# Altium schematic sheet LED_Board_Top.SchDoc: Top Sheet
size A; Author: Sam Tomlinson; SheetNumber: 1; SheetTotal: 6; TeamLead: John Ulm; ProjectTitle: LED Board
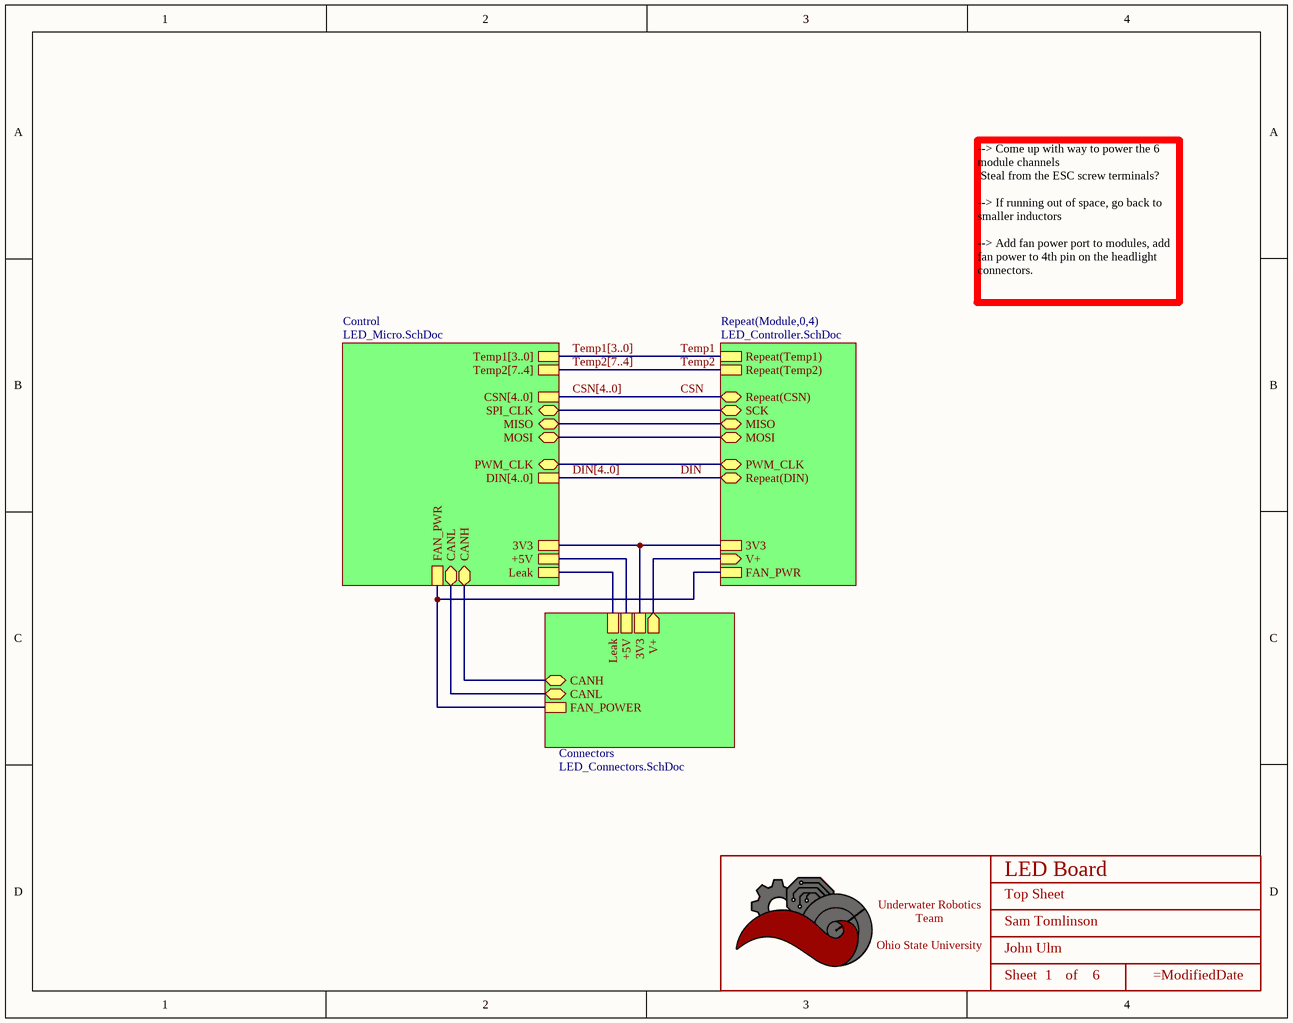
[diagram p0: LED_Board_Top.SchDoc]

## Parts
*  Title_Block  [LOGO]  (value not drawn)  (graphical)

## Sub-sheets
Connectors = LED_Connectors.SchDoc: Leak, +5V, 3V3, CANH (bidir), CANL (bidir), FAN_POWER, V+ (out)
Control = LED_Micro.SchDoc: +5V, 3V3, PWM_CLK (bidir), SPI_CLK (bidir), MISO (bidir), MOSI (bidir), CANH (bidir), CANL (bidir), FAN_PWR, DIN[4..0], CSN[4..0], Temp1[3..0], Leak, Temp2[7..4]
Repeat(Module,0,4) = LED_Controller.SchDoc: Repeat(CSN) (bidir), PWM_CLK (bidir), SCK (bidir), MOSI (bidir), MISO (bidir), Repeat(DIN) (bidir), V+ (in), Repeat(Temp1), 3V3, Repeat(Temp2), FAN_PWR

## Nets
CSN: sheet Repeat(Module,0,4)/Repeat(CSN)
DIN: sheet Repeat(Module,0,4)/Repeat(DIN)
Temp1: sheet Repeat(Module,0,4)/Repeat(Temp1)
Temp2: sheet Repeat(Module,0,4)/Repeat(Temp2)
(unnamed): sheet Connectors/Leak, sheet Control/Leak
(unnamed): sheet Connectors/+5V, sheet Control/+5V
(unnamed): sheet Connectors/3V3, sheet Control/3V3, sheet Repeat(Module,0,4)/3V3
(unnamed): sheet Connectors/CANH, sheet Control/CANH
(unnamed): sheet Connectors/CANL, sheet Control/CANL
(unnamed): sheet Connectors/FAN_POWER, sheet Control/FAN_PWR, sheet Repeat(Module,0,4)/FAN_PWR
(unnamed): sheet Connectors/V+, sheet Repeat(Module,0,4)/V+
(unnamed): sheet Control/PWM_CLK, sheet Repeat(Module,0,4)/PWM_CLK
(unnamed): sheet Control/SPI_CLK, sheet Repeat(Module,0,4)/SCK
(unnamed): sheet Control/MISO, sheet Repeat(Module,0,4)/MISO
(unnamed): sheet Control/MOSI, sheet Repeat(Module,0,4)/MOSI

## Buses and harness runs
bus CSN[4..0] = sheet Control/CSN[4..0]
bus DIN[4..0] = sheet Control/DIN[4..0]
bus Temp1[3..0] = sheet Control/Temp1[3..0]
bus Temp2[7..4] = sheet Control/Temp2[7..4]

## Notes on the sheet
- --> Come up with way to power the 6 module channels
  Steal from the ESC screw terminals?
  --> If running out of space, go back to smaller inductors
  --> Add fan power port to modules, add fan power to 4th pin on the headlight connectors.
- (in symbol Title_Block) Underwater Robotics Team / Ohio State University; Sheet; of

## Library data of the parts
* = Title_Block: UWRT Schematic Title Block Template / Created June 2021, Dylan Trainor